# Altium schematic sheet EG2131.SchDoc
size A4
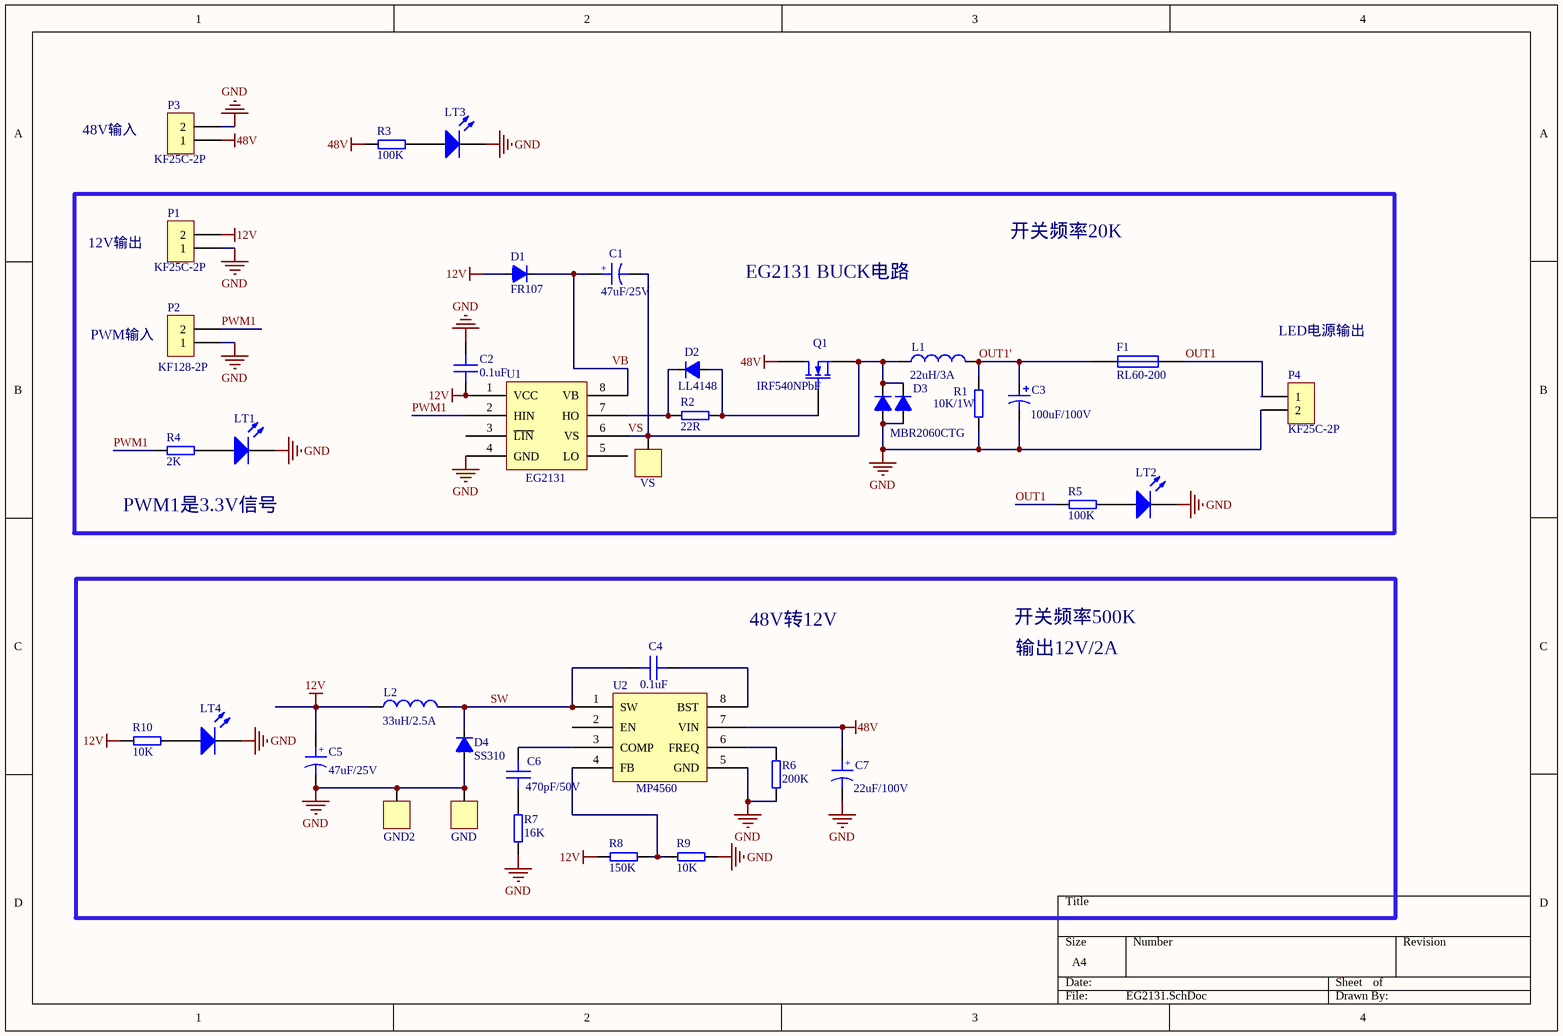
[diagram p0: EG2131.SchDoc]

## Parts
C1  value 47uF/25V  [CAP2MM]  (hidden comment: 25V-YXJ-47uF-M 5X11，Rubycon)
C2  value 0.1uF  [0805]  (hidden comment: 0.1uF/50V，X7R)
C3  value 100uF/100V  [CAP5MM]  (hidden comment: 100V-YXJ-100uF-M 10X20，Rubycon)
C4  value 0.1uF  [0805]  (hidden comment: 0.1uF/50V，X7R)
C5  value 47uF/25V  [CAP2MM]  (hidden comment: 25V-YXJ-47uF-M 5X11，Rubycon)
C6  470pF/50V  [0805]
C7  value 22uF/100V  [CAP2.5MM]  (hidden comment: 100V-YXJ-22uF-M 6.3X11，Rubycon)
D1  value FR107  [DO-41-3.8]  (hidden comment: FR107，MDD)
D2  value LL4148  [LL4148]  (hidden comment: LL4148,，MDD)
D3  value MBR2060CTG  [TO220-HS-2P]  (hidden comment: MBR2060CTG，ON)
D4  value SS310  [SMC]  (hidden comment: SS310，MDD)
F1  value RL60-200  [RL60-110]  (hidden comment: RL60-200，瑞隆源)
GND  Testpoint  [TEST]  (value not drawn)
GND2  Testpoint  [TEST]  (value not drawn)
L1  value 22uH/3A  [L_6.6*7.0]  (hidden comment: MWSA0603S-220MT，顺络)
L2  value 33uH/2.5A  [L_6.6*7.0]  (hidden comment: MWSA0603S-330MT，顺络)
LT1  红，0805  [led0805]  (value not drawn)
LT2  红，0805  [led0805]  (value not drawn)
LT3  红，0805  [led0805]  (value not drawn)
LT4  红，0805  [led0805]  (value not drawn)
P1  value KF25C-2P  [KF25C-2P]  (hidden comment: KF25C-2P ，间距7.62MM)
P2  value KF128-2P  [KF128-2P]  (hidden comment: KF128-2P ,间距5.08)
P3  value KF25C-2P  [KF25C-2P]  (hidden comment: KF25C-2P ，间距7.62MM)
P4  value KF25C-2P  [KF25C-2P]  (hidden comment: KF25C-2P ，间距7.62MM)
Q1  value IRF540NPbF  [TO220-HS-2P]  (hidden comment: IRF540NPbF，英飞凌)
R1  10K/1W  [1w]
R2  value 22R  [1206]  (hidden comment: 22R/F/金属膜)
R3  value 100K  [0805]  (hidden comment: 100K/F/金属膜)
R4  value 2K  [0805]  (hidden comment: 2K/F/金属膜)
R5  value 100K  [0805]  (hidden comment: 100K/F/金属膜)
R6  value 200K  [0805]  (hidden comment: 200K/F/金属膜)
R7  value 16K  [0805]  (hidden comment: 16K/F/金属膜)
R8  value 150K  [0805]  (hidden comment: 150K/F/金属膜)
R9  value 10K  [0805]  (hidden comment: 10K/F/金属膜)
R10  value 10K  [0805]  (hidden comment: 10K/F/金属膜)
U1  EG2131  [SO-8]
U2  value MP4560  [SO-8-MP4560]  (hidden comment: MP4560DN，MPS)
VS  Testpoint  [TEST]  (value not drawn)

## Nets
12V: C2.1 C5.1 D1.1 L2.1 P1.2 R8.2 R10.2 U1.1(VCC)
48V: C7.1 P3.1 Q1.2(D) R3.2 U2.7(VIN)
GND: C2.2 C3.2 C5.2 C7.2 D3.1(A) D3.3(A) D4.1 GND.1 GND2.1 LT1.2(K) LT2.2(K) LT3.2(K) LT4.2(K) P1.1 P2.1 P3.2 P4.2 R1.1 R6.2 R7.2 R9.1 U1.4(GND) U2.5(GND)
OUT1: F1.2 P4.1 R5.2
OUT1': C3.1 F1.1 L1.2 R1.2
PWM1: P2.2 R4.2 U1.2(HIN)
SW: C4.1 D4.2 L2.2 U2.1(SW)
VB: C1.1 D1.2 U1.8(VB)
VS: C1.2 D3.2(K) L1.1 Q1.3(S) U1.6(VS) VS.1
NetC4_2: C4.2 U2.8(BST)
NetC6_1: C6.1 R7.1
NetC6_2: C6.2 U2.3(COMP)
NetD2_1: D2.1 Q1.1(G) R2.2
NetD2_2: D2.2 R2.1 U1.7(HO)
NetLT1_1: LT1.1(A) R4.1
NetLT2_1: LT2.1(A) R5.1
NetLT3_1: LT3.1(A) R3.1
NetLT4_1: LT4.1(A) R10.1
NetR6_1: R6.1 U2.6(FREQ)
NetR8_1: R8.1 R9.2 U2.4(FB)

Not connected (* = marked no-connect by the designer): U1 3(~{LIN}) 5(LO); U2 2(EN)

## Notes on the sheet
- 48V输入
- 12V输出
- 开关频率20K
- EG2131 BUCK电路
- PWM输入
- LED电源输出
- PWM1是3.3V信号
- 48V转12V
- 开关频率500K
- 输出12V/2A
- (in symbol C-E-000042) +

## Library data of the parts
C1 C5 C7 = C-E-000042: 电解电容; Tolerance: 20%; Voltage: 25V; Name: 铝电解电容; Temperature Characteristics: -55℃/+105℃; Package: RB5/10; Part Number: C-E-000042; Note: rubycon
C2 C4 C6 = Capacitor _non polarized_chip: 贴片电容; Tolerance: 10%; Vendor: YAGEO; VendorP/N: CC0603KRX7R9BB104; Name: 贴片陶瓷电容; Voltage: 50V; Package: 0805; Temperature: *; Part Number: *
  C6: Value: 470pF/50V
C3 = Cap Pol1: 电解电容; Published: 8-Jun-2000; LatestRevisionDate: 17-Jul-2002; LatestRevisionNote: Re-released for DXP Platform.; PackageReference: RB7.6-15; Publisher: Altium Limited
D1 D2 D4 = 1N4148: 二极管
D3 = MBR2060: 二极管
F1 = Fuse 1: 保险丝; LatestRevisionDate: 17-Jul-2002; LatestRevisionNote: Re-released for DXP Platform.; PackageReference: PIN-W2/E2.8; Publisher: Altium Limited
GND GND2 VS = Testpoint: 测试点
L1 L2 = Inductor: 功率电感; Code_IEC: 1005; Published: 8-Jun-2000; LatestRevisionDate: 17-Jul-2002; LatestRevisionNote: Re-released for DXP Platform.; PackageReference: 0402-A; Publisher: Altium Limited; Code_JEITA: 0402
LT1-LT4 = LED2: 发光二极管; Published: 8-Jun-2000; LatestRevisionDate: 17-Jul-2002; LatestRevisionNote: Re-released for DXP Platform.; PackageVersion: Feb-2002; PackageReference: 3.2X1.6X1.1; Publisher: Altium Limited; Value: 红，0805
P1 P3 P4 = Header 2: 栅栏式接线端子; LatestRevisionDate: 17-Jul-2002; LatestRevisionNote: Re-released for DXP Platform.
P2 = Header 2: 螺钉式PCB端子; LatestRevisionDate: 17-Jul-2002; LatestRevisionNote: Re-released for DXP Platform.
Q1 = MOSFET-N: MOSFET; PackageDocument: 1995/1996; Published: 8-Jun-2000; LatestRevisionDate: 17-Jul-2002; LatestRevisionNote: Re-released for DXP Platform.; PackageReference: E3
R1 = Resistor1: 金属氧化膜电阻; Part Number: R-S-000195; Power: 1/10W; Tolerance: 1%; Comp: SMT; Max Working Voltage （V): 100; Package: R0603; Value: 10K/1W
R2-R10 = Resistor1: 贴片电阻; Part Number: R-S-000195; Power: 1/10W; Tolerance: 1%; Comp: SMT; Max Working Voltage （V): 100; Package: R0603
U1 = EG2131: 芯片; value: EG2131
U2 = MP4560: DCDC芯片